# EAGLE design rbds_transmitter (EAGLE 6.1)
AUTH: Jeremy Ruhland; LAST_DATE_TIME: 4/29/2014; VER: 1.0
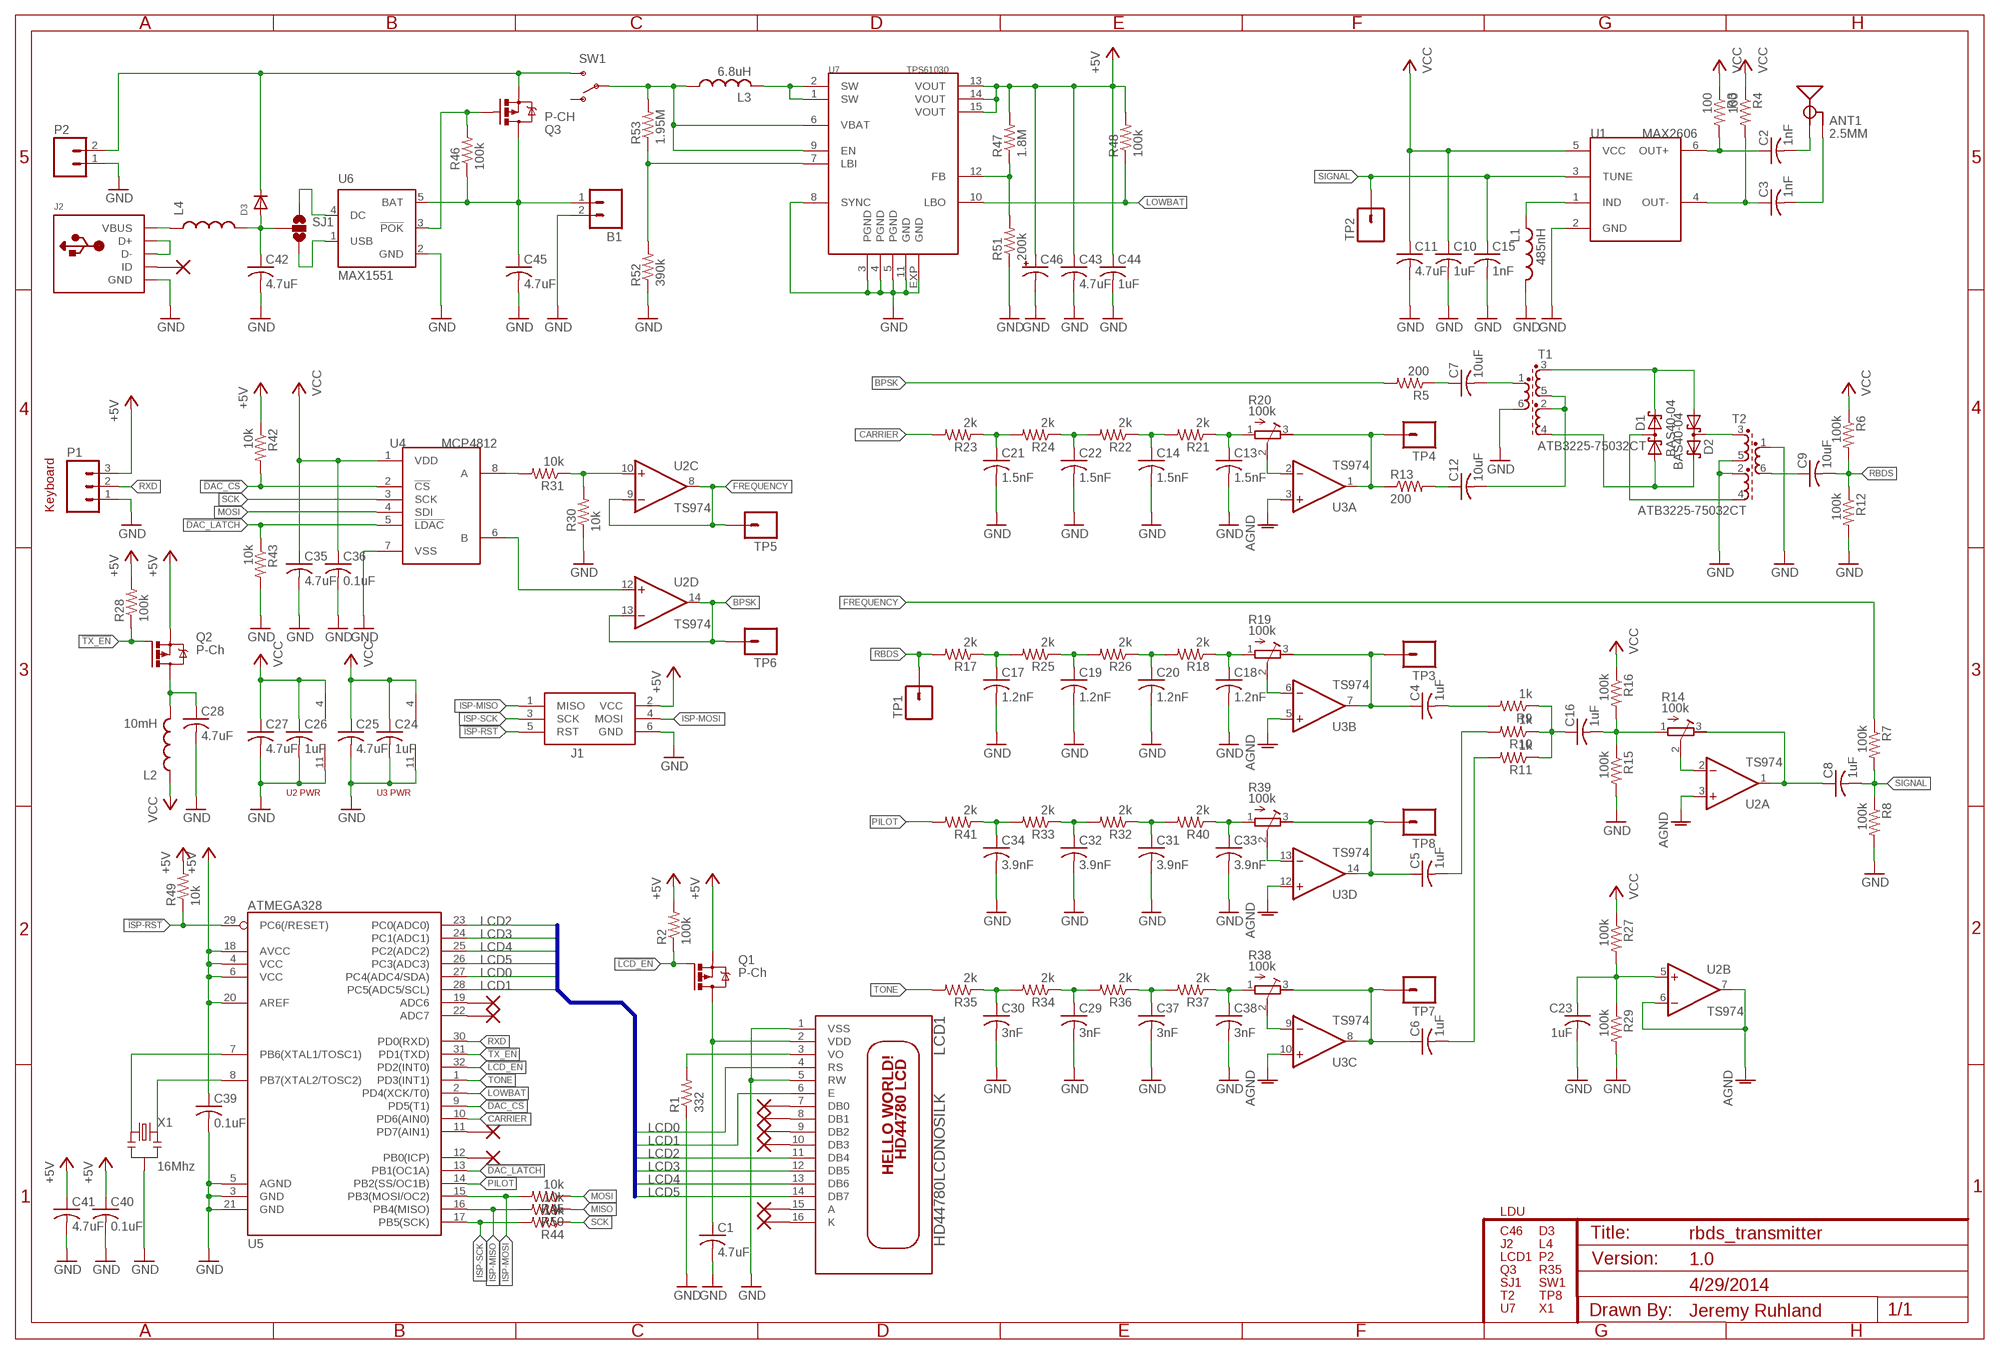
[diagram p0: schematic, sheet 1]

## Parts
ANT1  2.5MM  ANT2.5MM  [2.5MM_SCREW]
B1  M02-JST-2MM-SMT  [JST-2-SMD]
C1  4.7uF  C-USC1206  [C1206]
C2  1nF  C-USC1206  [C1206]
C3  1nF  C-USC1206  [C1206]
C4  1uF  C-USC1206  [C1206]
C5  1uF  C-USC1206  [C1206]
C6  1uF  C-USC1206  [C1206]
C7  10uF  C-USC1206  [C1206]
C8  1uF  C-USC1206  [C1206]
C9  10uF  C-USC1206  [C1206]
C10  1uF  C-USC1206  [C1206]
C11  4.7uF  C-USC1206  [C1206]
C12  10uF  C-USC1206  [C1206]
C13  1.5nF  C-USC1206  [C1206]
C14  1.5nF  C-USC1206  [C1206]
C15  1nF  C-USC1206  [C1206]
C16  1uF  C-USC1206  [C1206]
C17  1.2nF  C-USC1206  [C1206]
C18  1.2nF  C-USC1206  [C1206]
C19  1.2nF  C-USC1206  [C1206]
C20  1.2nF  C-USC1206  [C1206]
C21  1.5nF  C-USC1206  [C1206]
C22  1.5nF  C-USC1206  [C1206]
C23  1uF  C-USC1206  [C1206]
C24  1uF  C-USC1206  [C1206]
C25  4.7uF  C-USC1206  [C1206]
C26  1uF  C-USC1206  [C1206]
C27  4.7uF  C-USC1206  [C1206]
C28  4.7uF  C-USC1206  [C1206]
C29  3nF  C-USC1206  [C1206]
C30  3nF  C-USC1206  [C1206]
C31  3.9nF  C-USC1206  [C1206]
C32  3.9nF  C-USC1206  [C1206]
C33  3.9nF  C-USC1206  [C1206]
C34  3.9nF  C-USC1206  [C1206]
C35  4.7uF  C-USC1206  [C1206]
C36  0.1uF  C-USC1206  [C1206]
C37  3nF  C-USC1206  [C1206]
C38  3nF  C-USC1206  [C1206]
C39  0.1uF  C-USC1206  [C1206]
C40  0.1uF  C-USC1206  [C1206]
C41  4.7uF  C-USC1206  [C1206]
C42  4.7uF  C-USC1206  [C1206]
C43  4.7uF  C-USC1206  [C1206]
C44  1uF  C-USC1206  [C1206]
C45  4.7uF  C-USC1206  [C1206]
C46  CPOL-USE  [PANASONIC_E]
D1  BAS40-04  [SOT23]
D2  BAS40-04  [SOT23]
D3  DIODESOD-123  [SOD-123]
J1  AVRISP-6  [AVRISP]
J2  USBMINIB  [USB-MINIB]
L1  485nH  L-USL3216C  [L3216C]
L2  10mH  INDUCTOR1210  [1210]
L3  6.8uH  L  [8040]
L4  INDUCTOR1210  [1210]
LCD1  HD44780LCDNOSILK  [LCD1602_NOSILK]
P1  M03PTH  [1X03]
P2  M023.5MM  [SCREWTERMINAL-3.5MM-2]
Q1  P-Ch  IRLML5203  [MICRO3]
Q2  P-Ch  IRLML5203  [MICRO3]
Q3  P-CH  MOSFET-PCHANNELSMD  [SOT23-3]
R1  332  R-US_R1206  [R1206]
R2  100k  R-US_R1206  [R1206]
R3  100  R-US_R1206  [R1206]
R4  100  R-US_R1206  [R1206]
R5  200  R-US_R1206  [R1206]
R6  100k  R-US_R1206  [R1206]
R7  100k  R-US_R1206  [R1206]
R8  100k  R-US_R1206  [R1206]
R9  1k  R-US_R1206  [R1206]
R10  1k  R-US_R1206  [R1206]
R11  1k  R-US_R1206  [R1206]
R12  100k  R-US_R1206  [R1206]
R13  200  R-US_R1206  [R1206]
R14  100k  R-TRIMM3304W  [RTRIM3304W]
R15  100k  R-US_R1206  [R1206]
R16  100k  R-US_R1206  [R1206]
R17  2k  R-US_R1206  [R1206]
R18  2k  R-US_R1206  [R1206]
R19  100k  R-TRIMM3304W  [RTRIM3304W]
R20  100k  R-TRIMM3304W  [RTRIM3304W]
R21  2k  R-US_R1206  [R1206]
R22  2k  R-US_R1206  [R1206]
R23  2k  R-US_R1206  [R1206]
R24  2k  R-US_R1206  [R1206]
R25  2k  R-US_R1206  [R1206]
R26  2k  R-US_R1206  [R1206]
R27  100k  R-US_R1206  [R1206]
R28  100k  R-US_R1206  [R1206]
R29  100k  R-US_R1206  [R1206]
R30  10k  R-US_R1206  [R1206]
R31  10k  R-US_R1206  [R1206]
R32  2k  R-US_R1206  [R1206]
R33  2k  R-US_R1206  [R1206]
R34  2k  R-US_R1206  [R1206]
R35  2k  R-US_R1206  [R1206]
R36  2k  R-US_R1206  [R1206]
R37  2k  R-US_R1206  [R1206]
R38  100k  R-TRIMM3304W  [RTRIM3304W]
R39  100k  R-TRIMM3304W  [RTRIM3304W]
R40  2k  R-US_R1206  [R1206]
R41  2k  R-US_R1206  [R1206]
R42  10k  R-US_R1206  [R1206]
R43  10k  R-US_R1206  [R1206]
R44  10k  R-US_R1206  [R1206]
R45  10k  R-US_R1206  [R1206]
R46  100k  R-US_R1206  [R1206]
R47  1.8M  R-US_R1206  [R1206]
R48  100k  R-US_R1206  [R1206]
R49  10k  R-US_R1206  [R1206]
R50  10k  R-US_R1206  [R1206]
R51  200k  R-US_R1206  [R1206]
R52  390k  R-US_R1206  [R1206]
R53  1.95M  R-US_R1206  [R1206]
SJ1  SOLDERJUMPER_2WAYS  [SJ_3]
SW1  SWITCH-SPSTSMD2  [SWITCH-SPDT-SMD]
T1  ATB3225-75032CT  [TRANS]
T2  ATB3225-75032CT  [TRANS]
TP1  M01PTH  [1X01]
TP2  M01PTH  [1X01]
TP3  M01PTH  [1X01]
TP4  M01PTH  [1X01]
TP5  M01PTH  [1X01]
TP6  M01PTH  [1X01]
TP7  M01PTH  [1X01]
TP8  M01PTH  [1X01]
U1  MAX2606  [SOT23-6L]
U2  TS974  OPA4743UA  [SO14]
U3  TS974  OPA4743UA  [SO14]
U4  MCP4812  [SO-08]
U5  ATMEGA328  ATMEGA168  [TQFP32-08]
U6  MAX1551  [SOT23-5L]
U7  TPS61030  [HTSSOP16]
X1  16Mhz  RESONATORSMD  [RESONATOR-SMD]

## Nets
!DAC_CS: R42.2 U4.2(!CS) U5.9(PD5(T1))
!DAC_LATCH: R43.1 U4.5(!LDAC) U5.13(PB1(OC1A))
!ISP-RST: J1.5(RST) R49.1 U5.29(PC6(/RESET))
!LCD_EN: Q1.1(G) R2.1 U5.32(PD2(INT0))
!TX_EN: Q2.1(G) R28.1 U5.31(PD1(TXD))
+5V: C39.1 C40.1 C41.1 C43.1 C44.1 C46.+ J1.2(VCC) P1.3 Q1.2(S) Q2.2(S) R2.2 R28.2 R42.1 R47.2 R48.2 R49.2 U5.4(VCC) U5.6(VCC) U5.18(AVCC) U5.20(AREF) U7.13(VOUT) U7.14(VOUT) U7.15(VOUT)
AGND: U2.3(A:+IN) U2.6(B:-IN) U2.7(B:OUT) U3.3(A:+IN) U3.5(B:+IN) U3.10(C:+IN) U3.12(D:+IN)
BPSK: R5.2 TP6.1 U2.13(D:-IN) U2.14(D:OUT)
CARRIER: R23.2 U5.10(PD6(AIN0))
FREQUENCY: R7.1 TP5.1 U2.8(C:OUT) U2.9(C:-IN)
GND: B1.2 C1.2 C10.2 C11.2 C13.2 C14.2 C15.2 C17.2 C18.2 C19.2 C20.2 C21.2 C22.2 C23.2 C24.2 C25.2 C26.2 C27.2 C28.2 C29.2 C30.2 C31.2 C32.2 C33.2 C34.2 C35.2 C36.2 C37.2 C38.2 C39.2 C40.2 C41.2 C42.2 C43.2 C44.2 C45.2 C46.- J1.6(GND) J2.GND L1.1 LCD1.1(VSS) LCD1.5(RW) P1.1 P2.1 R1.1 R8.2 R12.2 R15.2 R29.2 R30.1 R43.2 R51.1 R52.1 T1.6 T2.1 T2.2 T2.5 U1.2(GND) U2.11(P:V-) U3.11(P:V-) U4.7(VSS) U5.3(GND) U5.5(AGND) U5.21(GND) U6.2(GND) U7.3(PGND) U7.4(PGND) U7.5(PGND) U7.8(SYNC) U7.11(GND) U7.EXP(GND) X1.2
ISP-MISO: J1.1(MISO) R50.2 U5.16(PB4(MISO))
ISP-MOSI: J1.4(MOSI) R45.2 U5.15(PB3(MOSI/OC2))
ISP-SCK: J1.3(SCK) R44.2 U5.17(PB5(SCK))
LCD0: LCD1.4(RS) U5.27(PC4(ADC4/SDA))
LCD1: LCD1.6(E) U5.28(PC5(ADC5/SCL))
LCD2: LCD1.11(DB4) U5.23(PC0(ADC0))
LCD3: LCD1.12(DB5) U5.24(PC1(ADC1))
LCD4: LCD1.13(DB6) U5.25(PC2(ADC2))
LCD5: LCD1.14(DB7) U5.26(PC3(ADC3))
LOWBAT: R48.1 U5.2(PD4(XCK/T0)) U7.10(LBO)
MISO: R50.1
MOSI: R45.1 U4.4(SDI)
N$1: C42.1 D3.A L4.2 SJ1.2
N$2: U5.8(PB7(XTAL2/TOSC2)) X1.3
N$3: D1.3(C1A2) T2.4
N$4: U5.7(PB6(XTAL1/TOSC1)) X1.1
N$5: C16.2 R14.1(A) R15.1 R16.2
N$7: SJ1.3 U6.1(USB)
N$8: SJ1.1 U6.4(DC)
N$9: LCD1.3(VO) R1.2
N$10: Q3.1(G) R46.2 U6.3(!POK)
N$11: B1.1 C45.1 Q3.3(D) R46.1 U6.5(BAT)
N$12: L3.1 U7.1(SW) U7.2(SW)
N$13: J2.D+ J2.D-
N$14: D2.3(C1A2) T2.3
N$15: D3.C P2.2 Q3.2(S) SW1.3(S)
N$16: D1.2(C2) D2.1(A1) T1.3
N$17: R47.1 R51.2 U7.12(FB)
N$18: D1.1(A1) D2.2(C2) T1.4
N$19: C12.2 T1.2 T1.5
N$20: C7.2 T1.1
N$21: C28.1 L2.2 Q2.3(D)
N$22: R14.2(S) U2.2(A:-IN)
N$23: C8.1 R14.3(E) U2.1(A:OUT)
N$24: L1.2 U1.1(IND)
N$25: C7.1 R5.1
N$26: C12.1 R13.2
N$27: R31.2 U4.8(A)
N$28: U2.12(D:+IN) U4.6(B)
N$33: C2.1 R3.2 U1.6(OUT+)
N$35: C3.1 R4.2 U1.4(OUT-)
N$39: ANT1.2(SIGNAL) C2.2
N$42: C9.1 T2.6
N$46: R30.2 R31.1 U2.10(C:+IN)
N$50: L3.2 R53.2 SW1.2(P) U7.6(VBAT) U7.9(EN)
N$52: ANT1.1(GND) C3.2
N$54: J2.VBUS L4.1
N$55: C21.1 R23.1 R24.2
N$59: C22.1 R22.2 R24.1
N$60: C19.1 R25.1 R26.2
N$61: C20.1 R18.2 R26.1
N$62: C18.1 R18.1 R19.1(A)
N$63: C13.1 R20.1(A) R21.1
N$64: R19.2(S) U3.6(B:-IN)
N$65: C4.1 R19.3(E) TP3.1 U3.7(B:OUT)
N$66: C23.1 R27.2 R29.1 U2.5(B:+IN)
N$67: C32.1 R32.2 R33.1
N$68: C31.1 R32.1 R40.2
N$69: C33.1 R39.1(A) R40.1
N$70: R39.2(S) U3.13(D:-IN)
N$71: C5.1 R39.3(E) TP8.1 U3.14(D:OUT)
N$72: C29.1 R34.1 R36.2
N$73: C37.1 R36.1 R37.2
N$74: C38.1 R37.1 R38.1(A)
N$75: R38.2(S) U3.9(C:-IN)
N$76: C6.1 R38.3(E) TP7.1 U3.8(C:OUT)
N$77: R20.2(S) U3.2(A:-IN)
N$78: C4.2 R9.2
N$79: C5.2 R10.2
N$80: C6.2 R11.2
N$81: C16.1 R9.1 R10.1 R11.1
N$82: R13.1 R20.3(E) TP4.1 U3.1(A:OUT)
N$83: C17.1 R17.1 R25.2
N$84: C34.1 R33.2 R41.1
N$85: C30.1 R34.2 R35.1
N$86: C14.1 R21.2 R22.1
PILOT: R41.2 U5.14(PB2(SS/OC1B))
RBDS: C9.2 R6.2 R12.1 R17.2 TP1.1
RXD: P1.2 U5.30(PD0(RXD))
SCK: R44.1 U4.3(SCK)
SIGNAL: C8.2 C15.1 R7.2 R8.1 TP2.1 U1.3(TUNE)
TONE: R35.2 U5.1(PD3(INT1))
U7: R52.2 R53.1 U7.7(LBI)
VCC: C10.1 C11.1 C24.1 C25.1 C26.1 C27.1 C35.1 C36.1 L2.1 R3.1 R4.1 R6.1 R16.1 R27.1 U1.5(VCC) U2.4(P:V+) U3.4(P:V+) U4.1(VDD)
VDD: C1.1 LCD1.2(VDD) Q1.3(D)
Unconnected: J2.ID LCD1.7(DB0) LCD1.8(DB1) LCD1.9(DB2) LCD1.10(DB3) LCD1.15(A) LCD1.16(K) SW1.1(O) U5.11(PD7(AIN1)) U5.12(PB0(ICP)) U5.19(ADC6) U5.22(ADC7)

## Buses
LCD[0..5]

## Notes on the sheet
- Keyboard
- U2 PWR | U3 PWR
- LDU
- C46 | D3
- J2 | L4
- LCD1 | P2
- Q3 | R35
- SJ1 | SW1
- T2 | TP8
- U7 | X1

## Library data of the parts
ANT1 = dipole_antenna:ANT
B1 P2 = sparkfun:M02: Header 2 Standard 2-pin 0.1" header. Use with straight break away headers (SKU : PRT-00116), right angle break away headers (PRT-00553), swiss pins (PRT-00743), machine pins (PRT-00117), and female headers (PRT-00115). Molex polarized connector foot print use with SKU : PRT-08233 with associated crimp pins and housings.
C1-C45 = adafruit:C-US: CAPACITOR, American symbol
C46 = adafruit:CPOL-US: POLARIZED CAPACITOR, American symbol
D1 D2 = diode:BAS40-04: Silicon Schottky Diodes General-purpose diode for high-speed switching
D3 = adafruit:DIODE: Diode SMADIODE - SMA Surface Mount Package 20V 1A Schottky Diode Digikey: 641-1014-6-ND DO-1N4148 - Through Hole Small Current Diode SOD-123 20V 1 A (.5mV Vf) Schottky Diode - Digikey: MBRX120TPMSCT-ND SOD-323 10V 570mA (.38mV Vf, 3ns) Schottky Diode - Digikey: ZLLS410CT-ND SOD-523 30V 30mA Schottky Diode (RB751S-40TE61) - Digikey: RB751S-40TE61CT-ND SOT23-R/W - SOT23 Package (R = Solder Paste/Reflow Ovens, W = Hand-Soldering) BAT54Film 40V 300mA - Digikey: 497-7162-1-ND
J1 = adafruit:AVRISP: AVR ISP HEADER Standard 6 pin header for AVR programming
J2 = adafruit:USB: USB Connectors USBMINIB - Surface Mount Female Mini-B USB Connector 4UConnector: 06564 By microbuilder.eu Thru-hole RA Female Mini-B USB Connector 4UConnector: 18732 By ladyada.net
L1 = resistor:L-US: INDUCTOR, American symbol
L2 L4 = sparkfun:INDUCTOR: Inductors Basic Inductor/Choke - 0603 and 1206. Footprints are not proven and vary greatly between part numbers.
L3 = yuden:L
LCD1 = adafruit:HD44780LCD: HD44780 LCD Standard character type LCDs, available in sizes from 8x1 to 40x4!
P1 = sparkfun:M03: Header 3 Standard 3-pin 0.1" header. Use with straight break away headers (SKU : PRT-00116), right angle break away headers (PRT-00553), swiss pins (PRT-00743), machine pins (PRT-00117), and female headers (PRT-00115). Molex polarized connector foot print use with SKU : PRT-08232 with associated crimp pins and housings.
Q1 Q2 = transistor-power:IRLML5203: HEXFET P-Channel Power MOSFET
Q3 = sparkfun:MOSFET-PCHANNEL
R1-R13 R15-R18 R21-R37 R40-R53 = adafruit:R-US_: RESISTOR, American symbol
R14 R19 R20 R38 R39 = rcl:R-TRIMM: Trimm resistor
SJ1 = sparkfun:SOLDERJUMPER_2WAY: Solder Jumper 2 way solder jumper
SW1 = sparkfun:SWITCH-SPST: SPST Switch Simple slide switch. Spark Fun Electronics SKU : COM-00102
T1 T2 = tdk:ATB3225-75032CT
TP1-TP8 = sparkfun:M01: Header 1 Standard 1-pin 0.1" header. Use with straight break away headers (SKU : PRT-00116), right angle break away headers (PRT-00553), swiss pins (PRT-00743), machine pins (PRT-00117), and female headers (PRT-00115).
U1 = maxim:MAX2606
U2 U3 = linear:OPA4743: 12V, 7MHz, CMOS, Rail-to-Rail I/O Quad OP AMP Source: http://focus.ti.com/lit/ds/sbos201/sbos201.pdf
U4 = microchip:MCP4812
U5 = sparkfun:ATMEGA168
U6 = maxim:MAX1551: Dual-Input USB/AC Adapter 1-Cell Li+ Battery Chargers Source: http://www.maxim-ic.com .. MAX1551-MAX1555.pdf; MF: MAXIM; MPN: MAX1551EZK-T; OC_FARNELL: 1628221; OC_NEWARK: 88H0599
U7 = texas:TPS61030
X1 = sparkfun:RESONATOR: Resonator Small SMD resonator. This is the itty bitty 10/20MHz resonators with built in caps. CSTCE10M0G55 and CSTCE20M0V53. Footprint has been reviewed closely but hasn't been tested yet.

## Board
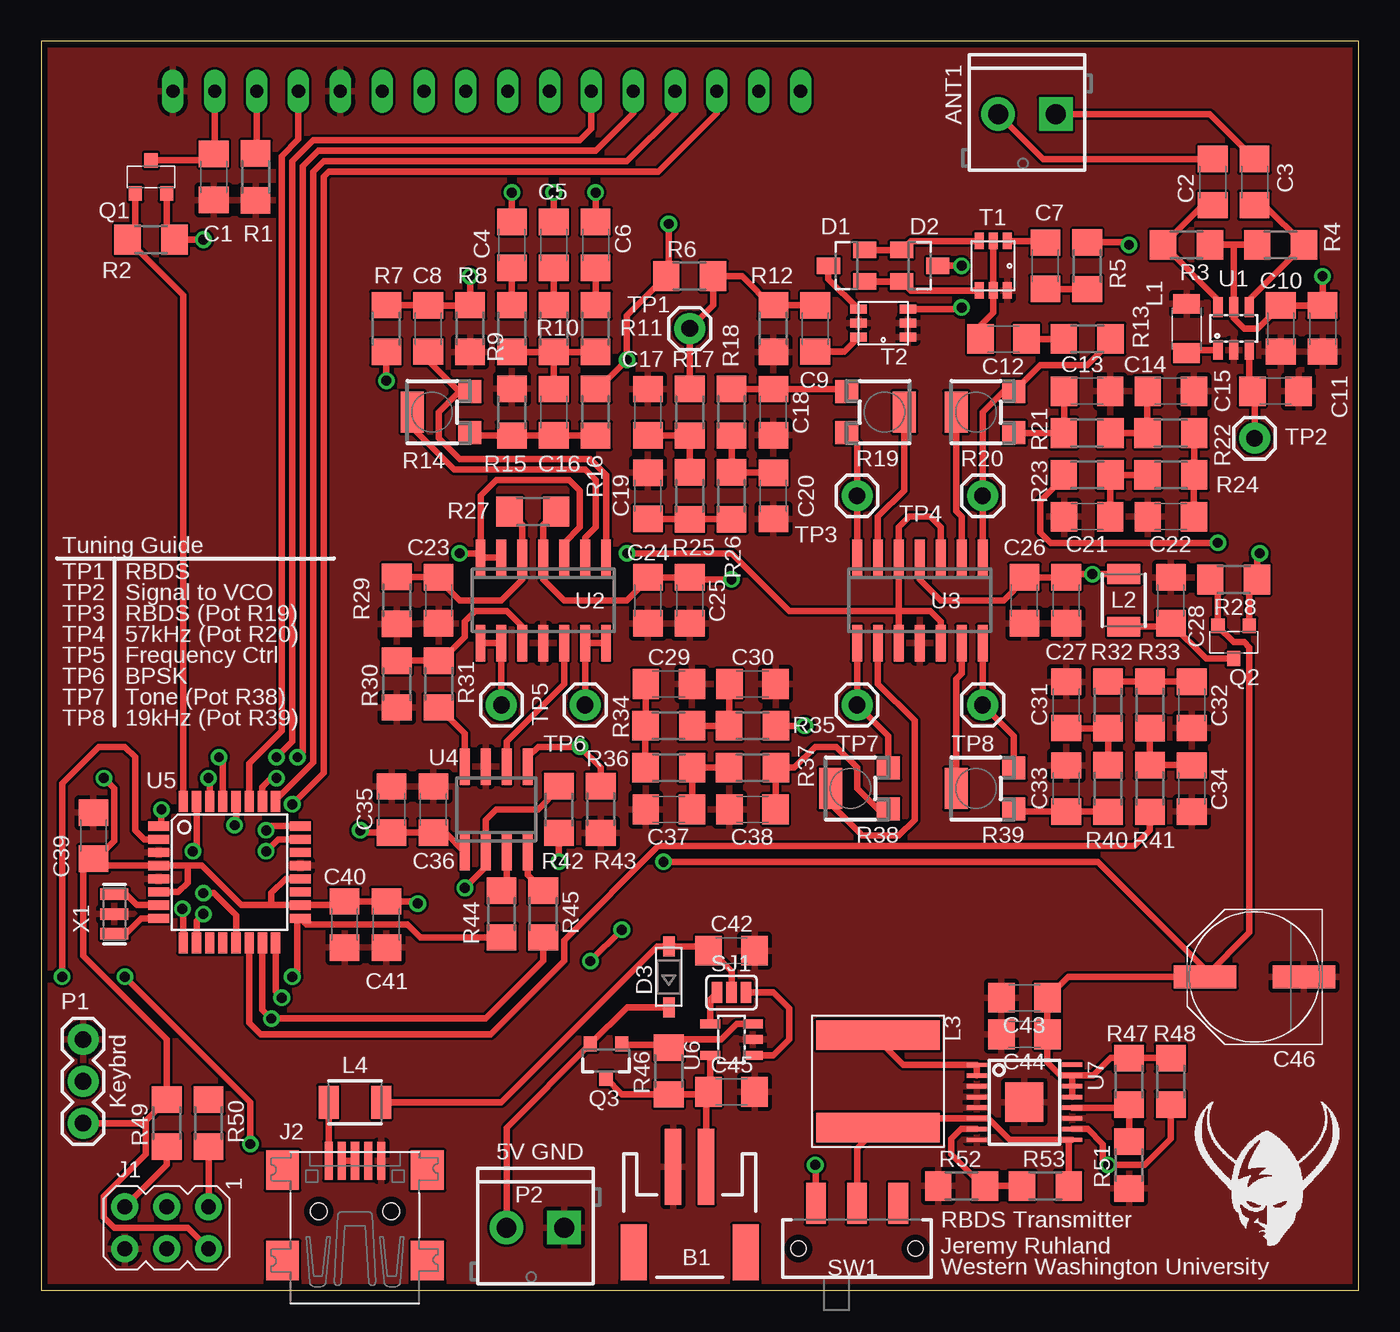
[diagram p1: board, top side]
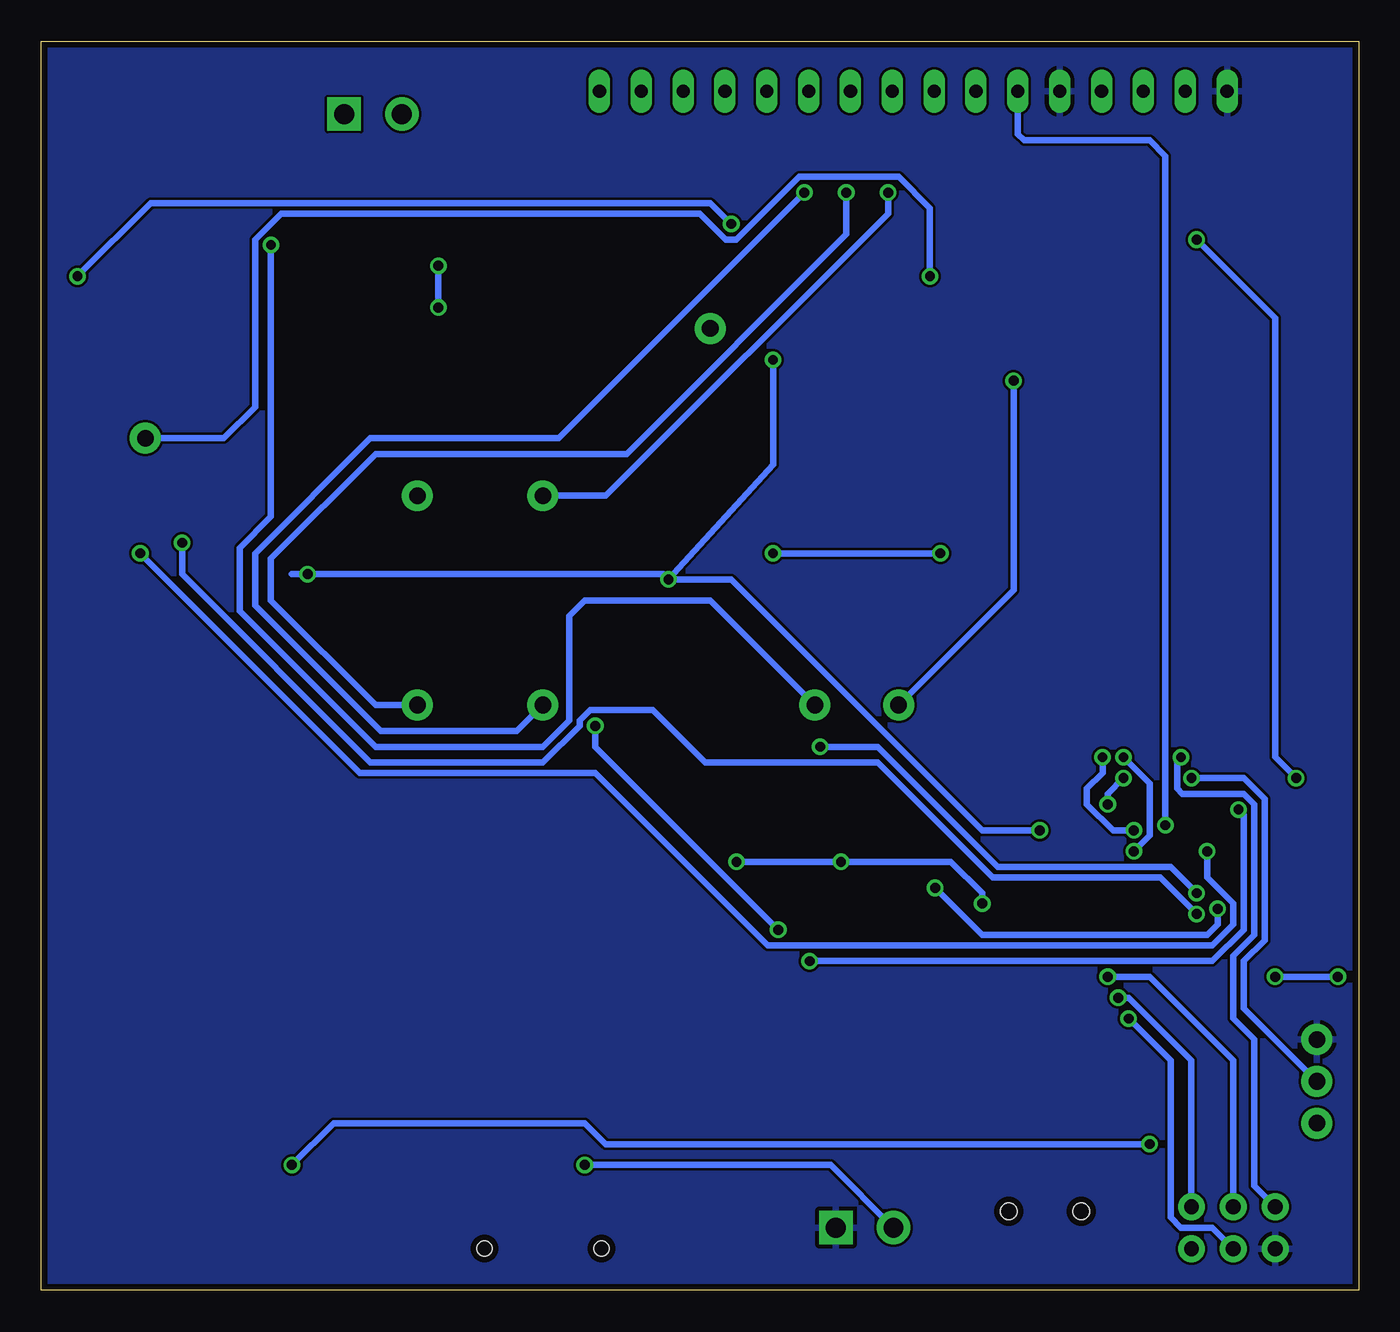
[diagram p2: board, bottom side, seen from below]

Size 79.99 x 75.87 mm. Coordinates in mm from the lower left corner, seen from the top.
Outline: 0,0 79.99,0 79.99,75.87 0,75.87 0,0
Copper layers (1*16): Top 0.035559375mm / dielectric 1.501140625mm / Bottom 0.035559375mm
Design rules: minimum track width 10mil, minimum drill 15mil, track to track 6mil, track to pad 6mil, pad to pad 6mil, via to via 6mil, smd to smd 6mil, copper to edge 15mil, drill to drill 8mil, minimum pad ring 10mil, minimum via ring 8mil, stop-mask expansion 4mil, vias tented up to drill 0mil, thermal gap 10mil

### Footprints (pad centres in the part's own frame; a part is rotated, then mirrored left to right if it is on the bottom)
2.5MM_SCREW = drill 1.2 pad 2.032 square: 1 -1.905,0 | drill 1.2 pad 2.032: 2 1.595,0
JST-2-SMD = smd 1 x 4.6: 1 -1,-3.7; 2 1,-3.7 | smd 1.6 x 3.4: NC1 -3.4,1.5; NC2 3.4,1.5
C1206 = smd 1.6 x 1.8: 1 -1.4,0; 2 1.4,0
PANASONIC_E = smd 3.8 x 1.4: + 3,0; - -3,0
SOT23 = smd 1 x 1.4: 1 -0.95,-1.1; 2 0.95,-1.1; 3 0,1.1
SOD-123 = smd 1.2 x 0.7: A 1.85,0; C -1.85,0
AVRISP = drill 0.9 pad 1.626: 1 -1.27,2.54; 2 1.27,2.54; 3 -1.27,0; 4 1.27,0; 5 -1.27,-2.54; 6 1.27,-2.54
USB-MINIB = smd 0.5 x 2.308: D+ 0,4.064; D- -0.8,4.064; GND 1.6,4.064; ID 0.8,4.064; VBUS -1.6,4.064 | smd 2 x 2.4: GND1 -4.4,-2; GND2 -4.4,3.5; GND3 4.4,3.5; GND4 4.4,-2 | hole 1: -2.2,1; 2.2,1
L3216C = smd 1.2 x 1.6: 1 -1.5,0; 2 1.5,0
1210 = smd 1.2 x 2: 1 -1.6,0; 2 1.6,0
8040 = smd 1.8 x 7.5: 1 -2.8,0; 2 2.8,0
LCD1602_NOSILK = drill 0.8 long: 1 8,33.46; 2 10.54,33.46; 3 13.08,33.46; 4 15.62,33.46; 5 18.16,33.46; 6 20.7,33.46; 7 23.24,33.46; 8 25.78,33.46; 9 28.32,33.46; 10 30.86,33.46; 11 33.4,33.46; 12 35.94,33.46; 13 38.48,33.46; 14 41.02,33.46; 15 43.56,33.46; 16 46.1,33.46
1X03 = drill 1.016 pad 1.88: 1 0,0; 2 2.54,0; 3 5.08,0
SCREWTERMINAL-3.5MM-2 = drill 1.2 pad 2.032 square: 1 0,0 | drill 1.2 pad 2.032: 2 3.5,0
MICRO3 = smd 0.8 x 0.9: 1 -0.95,-1; 2 0.95,-1; 3 0,1
SOT23-3 = smd 0.8 x 0.9: 1 -0.95,-1; 2 0.95,-1; 3 0,1.1
R1206 = smd 1.6 x 1.803: 1 -1.422,0; 2 1.422,0
RTRIM3304W = smd 1.4 x 1.4: 1 -1.25,-1.9; 3 1.25,-1.9 | smd 2.5 x 1.4: 2 0,1.6
SJ_3 = smd 0.635 x 1.27: 1 -0.889,0; 2 0,0; 3 0.889,0
SWITCH-SPDT-SMD = smd 1.2 x 2.5: 1 -2.5,-2.75; 2 0,-2.75; 3 2.5,-2.75 | hole 0.9: -3.55,0; 3.55,0
TRANS = smd 1 x 0.55: 1 -1.5,0.85; 2 -1.5,0; 3 -1.5,-0.85; 4 1.5,-0.85; 5 1.5,0; 6 1.5,0.85
1X01 = drill 1.016 pad 1.88: 1 0,0
SOT23-6L = smd 0.55 x 1.2: 1 -0.95,-1.3; 2 0,-1.3; 3 0.95,-1.3; 4 0.95,1.3; 5 0,1.3; 6 -0.95,1.3
SO14 = smd 0.6 x 2.2: 1 -3.81,-2.6; 2 -2.54,-2.6; 3 -1.27,-2.6; 4 0,-2.6; 5 1.27,-2.6; 6 2.54,-2.6; 7 3.81,-2.6; 8 3.81,2.6; 9 2.54,2.6; 10 1.27,2.6; 11 0,2.6; 12 -1.27,2.6; 13 -2.54,2.6; 14 -3.81,2.6
SO-08 = smd 0.6 x 2.2: 1 -1.905,-2.6; 2 -0.635,-2.6; 3 0.635,-2.6; 4 1.905,-2.6; 5 1.905,2.6; 6 0.635,2.6; 7 -0.635,2.6; 8 -1.905,2.6
TQFP32-08 = smd 1.27 x 0.559: 1 -4.293,2.8; 2 -4.293,2; 3 -4.293,1.2; 4 -4.293,0.4; 5 -4.293,-0.4; 6 -4.293,-1.2; 7 -4.293,-2; 8 -4.293,-2.8; 17 4.293,-2.8; 18 4.293,-2; 19 4.293,-1.2; 20 4.293,-0.4; 21 4.293,0.4; 22 4.293,1.2; 23 4.293,2; 24 4.293,2.8 | smd 0.559 x 1.27: 9 -2.8,-4.293; 10 -2,-4.293; 11 -1.2,-4.293; 12 -0.4,-4.293; 13 0.4,-4.293; 14 1.2,-4.293; 15 2,-4.293; 16 2.8,-4.293; 25 2.8,4.293; 26 2,4.293; 27 1.2,4.293; 28 0.4,4.293; 29 -0.4,4.293; 30 -1.2,4.293; 31 -2,4.293; 32 -2.8,4.293
SOT23-5L = smd 0.55 x 1.2: 1 -0.95,-1.3; 2 0,-1.3; 3 0.95,-1.3; 4 0.95,1.3; 5 -0.95,1.3
HTSSOP16 = smd 0.26 x 1.2: 1 -2.275,-2.9; 8 2.275,-2.9; 9 2.275,2.9 | smd 0.27 x 1.2: 2 -1.625,-2.9; 3 -0.975,-2.9; 4 -0.325,-2.9; 5 0.325,-2.9; 6 0.975,-2.9; 7 1.625,-2.9; 10 1.625,2.9; 11 0.975,2.9; 12 0.325,2.9; 13 -0.325,2.9; 14 -0.975,2.9; 15 -1.625,2.9; 16 -2.275,2.9 | smd 2.4 x 2.3: EXP 0,0
RESONATOR-SMD = smd 0.7 x 1.7: 1 -1.2,0; 2 0,0; 3 1.2,0

### Placement (x,y rotation side)
ANT1  59.69,71.44 180 top
B1  39.37,3.81 180 top
C1  10.48,67.63 270 top
C2  71.12,67.31 90 top
C3  73.66,67.31 90 top
C4  28.57,63.5 270 top
C5  31.11,63.5 270 top
C6  33.66,63.5 270 top
C7  60.96,62.23 90 top
C8  23.5,58.42 90 top
C9  46.99,58.42 90 top
C10  75.25,58.42 270 top
C11  77.79,58.42 270 top
C12  58.42,57.78 180 top
C13  63.5,54.61 0 top
C14  68.58,54.61 0 top
C15  74.93,54.61 0 top
C16  31.11,53.34 270 top
C17  36.83,53.34 90 top
C18  44.45,53.34 270 top
C19  36.83,48.26 90 top
C20  44.45,48.26 270 top
C21  63.5,46.99 180 top
C22  68.58,46.99 180 top
C23  24.13,41.91 270 top
C24  36.83,41.91 270 top
C25  39.37,41.91 270 top
C26  59.69,41.91 270 top
C27  62.23,41.91 270 top
C28  68.58,41.91 90 top
C29  38.1,36.83 0 top
C30  43.18,36.83 0 top
C31  62.23,35.56 90 top
C32  69.85,35.56 270 top
C33  62.23,30.48 90 top
C34  69.85,30.48 270 top
C35  21.27,29.21 90 top
C36  23.81,29.21 90 top
C37  38.1,29.21 180 top
C38  43.18,29.21 180 top
C39  3.17,27.62 90 top
C40  18.41,22.23 270 top
C41  20.95,22.23 270 top
C42  41.91,20.64 0 top
C43  59.69,17.78 180 top
C44  59.69,15.56 180 top
C45  41.91,12.06 0 top
C46  73.66,19.05 180 top
D1  48.9,62.23 90 top
D2  53.34,62.23 270 top
D3  38.1,19.05 90 top
J1  7.62,3.81 270 top
J2  19.05,3.81 0 top
L1  69.53,58.42 270 top
L2  65.72,41.91 270 top
L3  50.8,12.7 270 top
L4  19.05,11.43 0 top
LCD1  0,39.37 0 top
P1  2.54,15.24 270 top
P2  31.75,3.81 180 top
Q1  6.67,67.63 0 top
Q2  72.39,39.37 180 top
Q3  34.29,13.97 180 top
R1  13.02,67.63 90 top
R2  6.67,63.82 0 top
R3  69.53,63.5 180 top
R4  75.25,63.5 0 top
R5  63.5,62.23 90 top
R6  39.37,61.59 0 top
R7  20.95,58.42 90 top
R8  26.04,58.42 270 top
R9  28.57,58.42 90 top
R10  31.11,58.42 90 top
R11  33.66,58.42 90 top
R12  44.45,58.42 270 top
R13  63.5,57.78 180 top
R14  24.13,53.34 90 top
R15  28.57,53.34 90 top
R16  33.66,53.34 270 top
R17  39.37,53.34 90 top
R18  41.91,53.34 270 top
R19  50.8,53.34 270 top
R20  57.15,53.34 90 top
R21  63.5,52.07 0 top
R22  68.58,52.07 0 top
R23  63.5,49.53 180 top
R24  68.58,49.53 180 top
R25  39.37,48.26 90 top
R26  41.91,48.26 270 top
R27  29.84,47.31 180 top
R28  72.39,43.18 180 top
R29  21.59,41.91 270 top
R30  21.59,36.83 90 top
R31  24.13,36.83 270 top
R32  64.77,35.56 90 top
R33  67.31,35.56 270 top
R34  38.1,34.29 0 top
R35  43.18,34.29 0 top
R36  38.1,31.75 180 top
R37  43.18,31.75 180 top
R38  49.53,30.48 90 top
R39  57.15,30.48 90 top
R40  64.77,30.48 90 top
R41  67.31,30.48 270 top
R42  31.43,29.21 90 top
R43  33.97,29.21 270 top
R44  27.94,22.86 270 top
R45  30.48,22.86 270 top
R46  38.1,13.34 90 top
R47  66.04,12.7 90 top
R48  68.58,12.7 90 top
R49  7.62,10.16 90 top
R50  10.16,10.16 270 top
R51  66.04,7.62 90 top
R52  55.88,6.35 0 top
R53  60.96,6.35 0 top
SJ1  41.91,18.1 0 top
SW1  49.53,2.54 180 top
T1  57.78,62.23 270 top
T2  51.12,58.74 180 top
TP1  39.37,58.42 180 top
TP2  73.66,51.75 90 top
TP3  49.53,48.26 180 top
TP4  57.15,48.26 180 top
TP5  27.94,35.56 180 top
TP6  33.02,35.56 180 top
TP7  49.53,35.56 180 top
TP8  57.15,35.56 180 top
U1  72.39,58.42 0 top
U2  30.48,41.91 180 top
U3  53.34,41.91 180 top
U4  27.62,29.21 0 top
U5  11.43,25.4 0 top
U6  41.91,15.24 90 top
U7  59.69,11.43 270 top
X1  4.45,22.86 270 top

### Tracks (layer width: path | path; a pad name or v marks a point on that pad's centre or on a via)
!DAC_CS  (via drill 0.6)
  Top 0.406: R42.2 31.43,30.48 30.16,29.21 27.62,29.21 26.99,28.57 U4.2 26.99,25.72 v25.72,24.45 | U5.9 8.63,23.12 v8.57,23.18
  Bottom 0.406: v25.72,24.45 22.86,21.59 9.21,21.59 8.57,22.23 v8.57,23.18
!DAC_LATCH  (via drill 0.6)
  Top 0.406: U4.5 29.53,32.38 30.16,33.02 v32.7,33.02 33.97,31.75 R43.1 | v9.84,24.13 10.48,24.13 11.83,22.78 U5.13
  Bottom 0.406: v32.7,33.02 29.21,33.02 21.91,25.72 11.43,25.72 v9.84,24.13
!ISP-RST  (via drill 0.6)
  Top 0.406: U5.29 11.03,32.15 v10.79,32.38 | R49.1 7.62,7.62 J1.5
  Bottom 0.406: J1.5 6.35,6.35 6.35,15.24 7.62,16.51 7.62,20.32 6.35,21.59 6.35,29.53 6.99,30.16 10.71,30.16 11.03,30.48 11.03,32.15 v10.79,32.38
!LCD_EN
  Top 0.406: Q1.1 5.72,64.14 5.4,63.82 R2.1 8.63,60.43 U5.32
!TX_EN  (via drill 0.6)
  Top 0.406: U5.31 9.43,26.89 v9.21,26.67 | Q2.1 73.34,42.71 R28.1 73.81,44.6 v73.98,44.77
  Bottom 0.406: v73.98,44.77 60.64,31.43 46.35,31.43 35.88,20.95 8.89,20.95 7.62,22.23 7.62,23.5 9.21,25.08 v9.21,26.67
+5V  (via drill 0.6)
  Top 0.406: U7.13 U7.14 U7.15 | U7.15 63.85,13.05 64.92,14.12 R47.2 R48.2 | U7.15 61.88,13.05 61.09,13.84 C44.1 C43.1 62.36,19.05 C46.+ | Q1.2 7.62,64.29 R2.2 | 13.97,23.4 U5.18 18.19,23.4 C40.1 C41.1 22.73,23.62 v22.86,23.5 | 13.97,23.4 12.16,23.4 9.76,25.8 8.89,25.8 | 8.89,25.8 U5.4 3.6,25.8 C39.1 | U5.20 14.84,25 13.97,24.13 13.97,23.4 | R42.1 v31.43,26.04 | J1.2 8.89,3.81 4.45,3.81 3.81,4.45 3.81,5.71 6.35,8.26 6.35,10.16 | P1.3 6.35,10.16 | 6.35,10.16 6.35,10.31 R49.2 7.62,15.24 2.54,20.32 2.54,25.59 C39.1 | R2.2 7.62,64.29 7.62,66.67 | C39.1 3.17,26.35 3.49,26.35 4.45,27.3 4.45,30.48 v3.81,31.11 | v9.84,63.82 R2.2 | R28.2 71.44,42.71 Q2.2 71.44,40.32 72.39,39.37 73.03,39.37 73.34,39.05 73.34,21.73 C46.+ | v37.78,26.04 64.14,26.04 70.66,19.51 C46.+ | U5.6 8.32,24.2 8.89,24.77 8.89,25.8
  Bottom 0.406: v22.86,23.5 22.86,24.13 24.77,26.04 v31.43,26.04 v37.78,26.04 | v9.84,63.82 5.08,59.05 5.08,32.38 v3.81,31.11
AGND  (via drill 0.6)
  Top 0.406: U3.12 54.61,40.64 53.98,41.27 52.07,41.27 | U3.10 52.07,41.27 | 52.07,41.27 U3.5 52.07,46.35 52.7,46.99 53.98,46.99 54.61,46.35 U3.3 | U2.7 U2.6 | U2.3 31.75,45.4 32.7,46.35 32.7,48.58 32.07,49.21 27.62,49.21 26.67,48.26 U2.7 | 52.07,41.27 45.4,41.27 41.91,44.77 v35.56,44.77 | v25.4,44.77 26.41,44.77 U2.7
  Bottom 0.406: v35.56,44.77 v25.4,44.77
BPSK  (via drill 0.6)
  Top 0.406: U2.14 33.08,39.31 33.02,39.37 U2.13 TP6.1 | R5.2 65.89,63.65 v66.04,63.5
  Bottom 0.406: TP6.1 39.37,41.91 46.99,41.91 47.94,40.96 47.94,34.61 49.53,33.02 59.69,33.02 67.94,41.27 67.94,45.09 66.04,46.99 v66.04,63.5
CARRIER  (via drill 0.6)
  Top 0.406: R23.2 62.08,49.38 60.64,47.94 60.64,46.04 61.28,45.4 v71.44,45.4 | U5.10 9.43,22.45 v9.84,22.86
  Bottom 0.406: v71.44,45.4 71.44,43.5 60.01,32.07 49.53,32.07 47.31,34.29 47.31,34.61 46.67,35.24 42.86,35.24 39.69,32.07 29.21,32.07 22.23,25.08 12.06,25.08 v9.84,22.86
FREQUENCY  (via drill 0.6)
  Top 0.406: U2.8 U2.9 TP5.1 | R7.1 v20.95,55.24
  Bottom 0.406: v20.95,55.24 20.95,42.55 TP5.1
GND
  pour Top: 0,0 0,76.2 80.01,76.2 80.01,0
  pour Bottom: 0,0 0,76.2 80.01,76.2 80.01,0
ISP-MISO  (via drill 0.6)
  Top 0.406: R50.2 J1.1 | U5.16 14.23,18.16 v14.61,17.78
  Bottom 0.406: J1.1 10.16,13.97 13.97,17.78 v14.61,17.78
ISP-MOSI  (via drill 0.6)
  Top 0.406: R45.2 30.48,20 26.99,16.51 v13.97,16.51 13.43,17.05 U5.15
  Bottom 0.406: J1.4 8.89,3.81 10.79,3.81 11.43,4.45 11.43,13.97 v13.97,16.51
ISP-SCK  (via drill 0.6)
  Top 0.406: R44.2 23.01,21.44 22.23,22.23 16.1,22.23 U5.17 15.66,22.54 15.56,22.54 15.56,19.37 v15.24,19.05
  Bottom 0.406: J1.3 7.62,13.97 12.7,19.05 v15.24,19.05
LCD0
  Top 0.406: U5.27 12.63,32 14.61,33.97 14.61,68.9 15.62,69.91 LCD1.4
LCD1  (via drill 0.6)
  Top 0.406: U5.28 11.83,28.34 v11.75,28.26
  Bottom 0.406: v11.75,28.26 11.75,68.9 12.7,69.85 20.32,69.85 20.7,70.23 LCD1.6
LCD2  (via drill 0.6)
  Top 0.406: LCD1.11 33.4,70.55 32.7,69.85 16.51,69.85 15.24,68.58 15.24,33.34 v14.29,32.38 | U5.23 14.38,27.4 v13.65,26.67
  Bottom 0.406: v14.29,32.38 12.7,30.8 12.7,27.62 v13.65,26.67
LCD3  (via drill 0.6)
  Top 0.406: LCD1.12 35.94,71.5 33.66,69.22 16.83,69.22 15.88,68.26 15.88,32.7 v15.56,32.38 | U5.24 13.91,28.2 v13.65,27.94
  Bottom 0.406: v15.56,32.38 15.56,31.43 16.51,30.48 16.51,29.53 14.92,27.94 v13.65,27.94
LCD4
  Top 0.406: LCD1.13 38.48,71.5 35.56,68.58 17.14,68.58 16.51,67.94 16.51,32.07 14.23,29.79 U5.25
LCD5  (via drill 0.6)
  Top 0.406: LCD1.14 41.02,71.5 37.47,67.94 17.46,67.94 17.14,67.63 17.14,31.43 v15.24,29.53 | U5.26 13.43,30.57 13.97,31.11 v14.29,31.11
  Bottom 0.406: v15.24,29.53 15.24,30.16 v14.29,31.11
LOWBAT  (via drill 0.6)
  Top 0.406: U7.10 63.54,9.8 64.45,8.89 64.45,7.94 v64.77,7.62 66.99,7.62 68.58,9.21 R48.1 68.58,11.43 | v5.08,19.05 12.7,11.43 v12.7,8.89 | U5.2 6.25,27.4 5.71,27.94 5.71,32.38 5.08,33.02 3.49,33.02 1.27,30.8 v1.27,19.05
  Bottom 0.406: v5.08,19.05 v1.27,19.05 | v12.7,8.89 45.72,8.89 46.99,10.16 62.23,10.16 v64.77,7.62
MOSI
  Top 0.406: U4.4 29.53,25.23 R45.1
N$1
  Top 0.406: SJ1.2 41.91,19.37 40.64,20.64 C42.1 40.51,20.45 | 40.51,20.45 40.06,20.9 D3.A 37.41,20.9 27.94,11.43 L4.2 | 40.51,20.45 40.64,20.32
N$2
  Top 0.406: U5.8 6.09,22.6 5.08,21.59 4.51,21.59 X1.3
N$3
  Top 0.406: T2.4 47.8,61.41 D1.3
N$4
  Top 0.406: U5.7 5.81,23.4 5.08,24.13 4.51,24.13 X1.1
N$5
  Top 0.406: R16.2 31.27,51.92 31.11,52.07 C16.2 31.09,51.92 R15.1 26.03,51.92 R14.1
N$7
  Top 0.406: U6.1 44.45,14.29 45.4,15.24 45.4,17.14 44.45,18.1 SJ1.3
N$8
  Top 0.406: U6.4 40.61,17.69 SJ1.1
N$9
  Top 0.406: R1.2 13.08,69.11 LCD1.3
N$10
  Top 0.406: U6.3 42.23,16.19 41.27,15.24 38.42,15.24 38.1,14.92 | 38.1,14.92 38.1,15.24 | R46.2 38.1,14.92 | 38.1,14.92 35.29,14.92 Q3.1
N$11
  Top 0.406: U6.5 40.61,12.16 C45.1 | C45.1 40.36,11.91 R46.1 35.25,11.91 Q3.3 | B1.1 40.37,11.93 C45.1
N$12
  Top 0.406: L3.1 50.8,15.24 52.34,13.71 U7.1 U7.2
N$13
  Top 0.406: J2.D- J2.D+
N$14  (via drill 0.6)
  Top 0.406: D2.3 v55.88,62.23 | v55.88,59.69 55.78,59.59 T2.3
  Bottom 0.406: v55.88,62.23 v55.88,59.69
N$15  (via drill 0.6)
  Top 0.406: D3.C 35.57,17.2 Q3.2 28.25,9.88 P2.2 | SW1.3 47.03,7.58 v46.99,7.62
  Bottom 0.406: v46.99,7.62 32.06,7.62 P2.2
N$16
  Top 0.406: D1.2 D2.1 52.79,63.73 T1.3
N$17
  Top 0.254: 65.87,11.11 R47.1
  Top 0.406: U7.12 65.87,11.11 | R51.2 R47.1
N$18
  Top 0.406: D1.1 D2.2 52.79,60.73 T1.4
N$19
  Top 0.406: T1.2 T1.5 57.78,59.37 57.02,58.61 C12.2
N$20
  Top 0.406: T1.1 60.96,63.73 C7.2
N$21
  Top 0.406: L2.2 68.38,40.31 C28.1 70.72,38.37 Q2.3
N$22
  Top 0.406: R14.2 22.53,52.4 25.08,49.85 33.02,49.85 33.66,49.21 33.66,46.35 33.02,45.72 U2.2
N$23
  Top 0.406: R14.3 25.38,54.59 | 25.38,54.59 24.13,53.34 24.13,51.75 25.4,50.48 33.34,50.48 34.29,49.53 U2.1 | C8.1 23.5,56.48 25.38,54.59
N$24
  Top 0.406: U1.1 69.88,57.12 69.85,57.15 L1.2
N$25
  Top 0.406: R5.1 61.11,60.81 60.96,60.96 C7.1
N$26
  Top 0.406: R13.2 C12.1
N$27
  Top 0.406: U4.8 25.72,33.82 R31.2
N$28
  Top 0.406: U2.12 31.75,36.83 28.26,33.34 U4.6
N$33
  Top 0.406: U1.6 71.44,60.17 R3.2 70.52,65.91 C2.1
N$35
  Top 0.406: U1.4 73.34,60.17 R4.2 74.26,65.91 C3.1
N$39
  Top 0.406: ANT1.2 60.82,68.71 C2.2
N$42
  Top 0.406: T2.6 48.75,57.02 C9.1
N$46
  Top 0.406: R30.2 R31.1 24.28,38.25 | U2.10 29.21,40.32 28.26,41.27 26.35,41.27 25.72,40.64 25.72,39.69 24.28,38.25 | 24.28,38.25 24.13,38.1
N$50
  Top 0.254: 62.38,8.95 U7.9 | 51.09,10.46 50.8,10.16 L3.2
  Top 0.406: U7.9 58.79,9.15 57.49,10.46 U7.6 51.09,10.46 | R53.2 62.38,8.95 | SW1.2 49.53,8.63 L3.2
N$52
  Top 0.406: ANT1.1 70.93,71.44 C3.2
N$54
  Top 0.406: J2.VBUS 17.45,11.1 17.78,11.43 L4.1
N$55
  Top 0.406: C21.1 64.9,49.51 R23.1 R24.2
N$59
  Top 0.406: C22.1 69.98,49.51 R24.1 R22.2
N$60
  Top 0.406: C19.1 39.35,46.86 R25.1 R26.2
N$61
  Top 0.406: C20.1 41.93,49.66 R26.1 R18.2
N$62
  Top 0.406: R18.1 41.93,54.74 C18.1 48.75,54.74 R19.1
N$63
  Top 0.406: C13.1 62.1,52.09 R21.1 59.07,52.07 R20.1
N$64
  Top 0.406: R19.2 52.4,48.59 50.8,46.99 U3.6
N$65  (via drill 0.6)
  Top 0.406: U3.7 TP3.1 49.53,51.46 R19.3 | C4.1 v28.57,66.67
  Bottom 0.406: v28.57,66.67 28.57,65.41 45.72,48.26 TP3.1
N$66
  Top 0.406: R27.2 29.21,46.52 U2.5 29.21,43.18 27.94,41.91 25.4,41.91 24.13,43.18 C23.1 24.11,43.33 R29.1
N$67
  Top 0.406: R32.2 R33.1 69.83,36.98 C32.1
N$68
  Top 0.406: R40.2 R32.1 62.25,34.14 C31.1
N$69
  Top 0.406: R40.1 64.75,29.08 C33.1 59.2,29.08 R39.1
N$70
  Top 0.406: U3.13 55.88,37.47 55.56,37.15 55.56,30.49 R39.2
N$71  (via drill 0.6)
  Top 0.406: R39.3 59.05,33.66 TP8.1 U3.14 57.15,39.37 | C5.1 v31.11,66.67
  Bottom 0.406: v31.11,66.67 31.11,64.14 44.45,50.8 59.69,50.8 66.04,44.45 66.04,41.91 59.69,35.56 TP8.1
N$72
  Top 0.406: C29.1 36.7,34.31 R34.1 R36.2
N$73
  Top 0.406: R37.2 R36.1 39.52,29.23 C37.1
N$74
  Top 0.406: C38.1 44.45,29.21 44.6,29.36 R37.1 45.72,31.75 46.99,33.02 48.26,33.02 49.53,31.75 49.53,30.48 50.78,29.23 R38.1
N$75
  Top 0.406: R38.2 47.93,29.54 49.85,27.62 52.07,27.62 53.02,28.57 53.02,34.61 50.8,36.83 U3.9 50.8,39.37
N$76  (via drill 0.6)
  Top 0.406: U3.8 TP7.1 51.43,33.66 R38.3 | C6.1 v33.66,66.67
  Bottom 0.406: v33.66,66.67 48.58,51.75 60.01,51.75 66.99,44.77 66.99,41.59 59.37,33.97 51.12,33.97 TP7.1
N$77
  Top 0.406: R20.2 55.55,47.32 55.88,46.99 U3.2
N$78
  Top 0.406: R9.2 C4.2
N$79
  Top 0.406: R10.2 C5.2
N$80
  Top 0.406: C6.2 R11.2 33.66,59.69
N$81
  Top 0.406: R11.1 R10.1 | R9.1 R10.1 | R10.1 C16.1
N$82
  Top 0.406: U3.1 TP4.1 57.15,53.34 58.4,54.59 R20.3 60.66,56.2 63.5,56.2 64.92,57.62 R13.1
N$83
  Top 0.406: R25.2 R17.1 36.85,51.92 C17.1
N$84
  Top 0.406: R33.2 R41.1 69.83,31.9 C34.1
N$85
  Top 0.406: C30.1 41.78,34.31 R35.1 R34.2
N$86
  Top 0.406: R21.2 R22.1 67.16,54.59 C14.1
PILOT
  Top 0.406: U5.14 12.63,16.26 13.34,15.56 27.3,15.56 31.75,20 31.75,21.27 37.47,26.99 66.36,26.99 67.31,27.94 R41.2
RBDS
  Top 0.406: C9.2 46.97,59.84 R12.1 44.45,59.69 42.55,61.59 R6.2 40.79,59.84 TP1.1 R17.2 39.37,54.61
RXD  (via drill 0.6)
  Top 0.406: U5.30 10.23,31.05 v10.16,31.11
  Bottom 0.406: P1.2 6.99,17.14 6.99,20 5.71,21.27 5.71,29.84 6.99,31.11 v10.16,31.11
SCK
  Top 0.406: U4.3 28.26,24.6 R44.1
SIGNAL  (via drill 0.6)
  Top 0.406: R7.2 23.47,59.84 C8.2 26.01,59.82 R8.1 v26.04,61.59 | U1.3 73.34,54.8 C15.1 73.66,54.48 TP2.1 73.66,54.61 73.34,54.93 U1.3
  Bottom 0.406: v26.04,61.59 26.04,65.72 27.94,67.63 33.97,67.63 37.78,63.82 38.42,63.82 40.01,65.41 65.41,65.41 66.99,63.82 66.99,53.66 68.9,51.75 TP2.1
TONE  (via drill 0.6)
  Top 0.406: U5.1 7.3,28.36 v7.3,29.21 | R35.2 v46.35,34.29 | v35.24,21.91 v33.34,20
  Bottom 0.406: v35.24,21.91 46.35,33.02 v46.35,34.29 | v33.34,20 8.89,20 6.99,21.91 6.99,28.89 v7.3,29.21
U7
  Top 0.406: R53.1 R52.2 57.15,6.35 55.24,8.26 55.24,9.21 55.84,9.8 U7.7
VCC  (via drill 0.6)
  Top 0.406: R4.1 72.39,63.5 | 72.39,63.5 R3.1 | 72.39,63.5 U1.5 72.39,59.05 73.03,58.42 73.85,58.42 C10.1 C11.1 | U3.4 53.34,43.18 54.61,41.91 58.42,41.91 59.69,43.18 C26.1 C27.1 62.43,43.51 | R27.1 30.48,46.52 U2.4 30.48,43.18 31.75,41.91 35.56,41.91 36.83,43.18 C24.1 C25.1 39.5,43.18 v41.91,43.18 | C36.1 C35.1 | C36.1 24.52,27.81 U4.1 | L2.1 62.43,43.51 | 62.43,43.51 62.43,43.5 v63.82,43.5 | R16.1 33.81,54.76 v35.56,56.52 35.56,59.21 R6.1 38.1,62.23 v38.1,64.77 | C36.1 19.5,27.81 v19.37,27.94 | C11.1 v77.79,61.59 77.79,60.01 77.47,59.69 77.66,59.69 | C11.1 77.79,59.69 77.66,59.69 | C11.1 77.66,59.69
  Bottom 0.406: v41.91,43.18 42.23,43.5 v63.82,43.5 64.77,43.51 | v35.56,56.52 35.56,50.16 v41.91,43.18 | v19.37,27.94 22.86,27.94 38.1,43.18 v41.91,43.18 | v38.1,64.77 39.37,66.04 73.34,66.04 v77.79,61.59
VDD
  Top 0.406: Q1.3 10.08,68.63 C1.1 10.54,69.09 LCD1.2

### Text on the board
_tsilk: Tuning Guide | TP1 | RBDS | TP2 | Signal to VCO | TP3 | RBDS (Pot R19) | TP4 | 57kHz (Pot R20) | TP5 | Frequency Ctrl | TP6 | BPSK | TP7 | Tone (Pot R38) | TP8 | 19kHz (Pot R39) | Keybrd | 5V GND | RBDS Transmitter | Jeremy Ruhland | Western Washington University